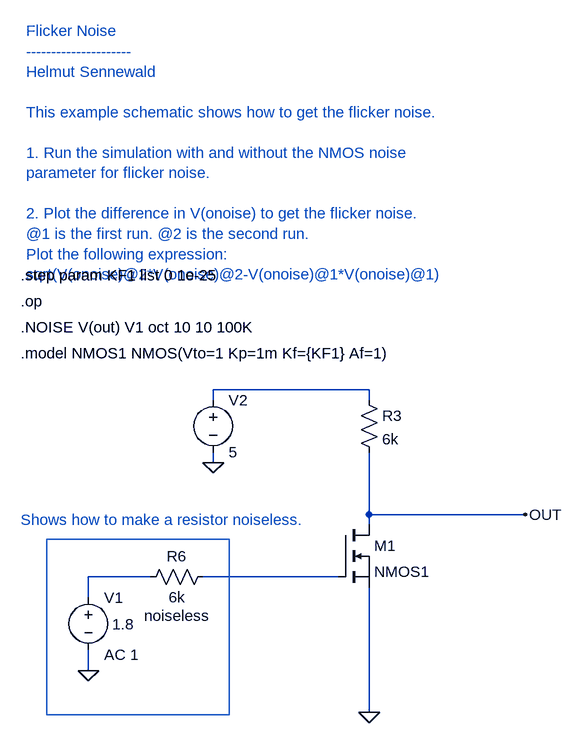
[diagram p0: schematic Flicker1.asc]
Flicker1.asc, the LTspice schematic file:
Version 4
SHEET 1 3088 1688
WIRE 1568 1136 1568 1104
WIRE 1568 1248 1568 1216
WIRE 1664 1104 1568 1104
WIRE 1760 832 1760 816
WIRE 1760 928 1760 912
WIRE 1952 1104 1744 1104
WIRE 2000 816 1760 816
WIRE 2000 832 2000 816
WIRE 2000 1008 2000 912
WIRE 2000 1024 2000 1008
WIRE 2000 1312 2000 1120
WIRE 2240 1008 2000 1008
FLAG 1760 928 0
FLAG 1568 1248 0
FLAG 2240 1008 OUT
FLAG 2000 1312 0
SYMBOL voltage 1760 816 R0
SYMATTR InstName V2
SYMATTR Value 5
SYMBOL voltage 1568 1120 R0
WINDOW 3 37 57 Left 0
WINDOW 123 24 104 Left 0
WINDOW 39 0 0 Left 0
SYMATTR Value 1.8
SYMATTR Value2 AC 1
SYMATTR InstName V1
SYMBOL res 1984 816 R0
SYMATTR InstName R3
SYMATTR Value 6k
SYMBOL res 1760 1088 R90
WINDOW 0 0 56 VBottom 0
WINDOW 3 32 56 VTop 0
WINDOW 123 60 56 VTop 0
SYMATTR InstName R6
SYMATTR Value 6k
SYMATTR Value2 noiseless
SYMBOL nmos 1952 1024 R0
SYMATTR InstName M1
SYMATTR Value NMOS1
TEXT 1464 720 Left 0 !.NOISE V(out) V1 oct 10 10 100K
TEXT 1464 1016 Left 0 ;Shows how to make a resistor noiseless.
TEXT 1472 264 Left 0 ;Flicker Noise\n---------------------\nHelmut Sennewald\n \nThis example schematic shows how to get the flicker noise.\n \n1. Run the simulation with and without the NMOS noise \nparameter for flicker noise.\n \n2. Plot the difference in V(onoise) to get the flicker noise.\n@1 is the first run. @2 is the second run.\nPlot the following expression: \nsqrt(V(onoise)@2*V(onoise)@2-V(onoise)@1*V(onoise)@1)
TEXT 1464 760 Left 0 !.model NMOS1 NMOS(Vto=1 Kp=1m Kf={KF1} Af=1)
TEXT 1464 680 Left 0 !.op
TEXT 1464 640 Left 0 !.step param KF1 list 0 1e-25
LINE Normal 1785 1046 1504 1046
LINE Normal 1785 1316 1785 1046
LINE Normal 1785 1316 1504 1316
LINE Normal 1504 1316 1504 1046

The netlist it stands for:
* Flicker1.asc
V2 N002 0 5
V1 N001 0 1.8 AC 1
R3 N002 OUT 6k
R6 N003 N001 6k noiseless
M1 OUT N003 0 0 NMOS1
.model NMOS NMOS
.model PMOS PMOS
.lib standard.mos
.NOISE V(out) V1 oct 10 10 100K
* Shows how to make a resistor noiseless.
* Flicker Noise
* ---------------------
* Helmut Sennewald
* This example schematic shows how to get the flicker noise.
* 1. Run the simulation with and without the NMOS noise
* parameter for flicker noise.
* 2. Plot the difference in V(onoise) to get the flicker noise.
* @1 is the first run. @2 is the second run.
* Plot the following expression:
* sqrt(V(onoise)@2*V(onoise)@2-V(onoise)@1*V(onoise)@1)
.model NMOS1 NMOS(Vto=1 Kp=1m Kf={KF1} Af=1)
.op
.step param KF1 list 0 1e-25
.backanno
.end